# EAGLE design blackmagic_probe_r1 (EAGLE 5.12)
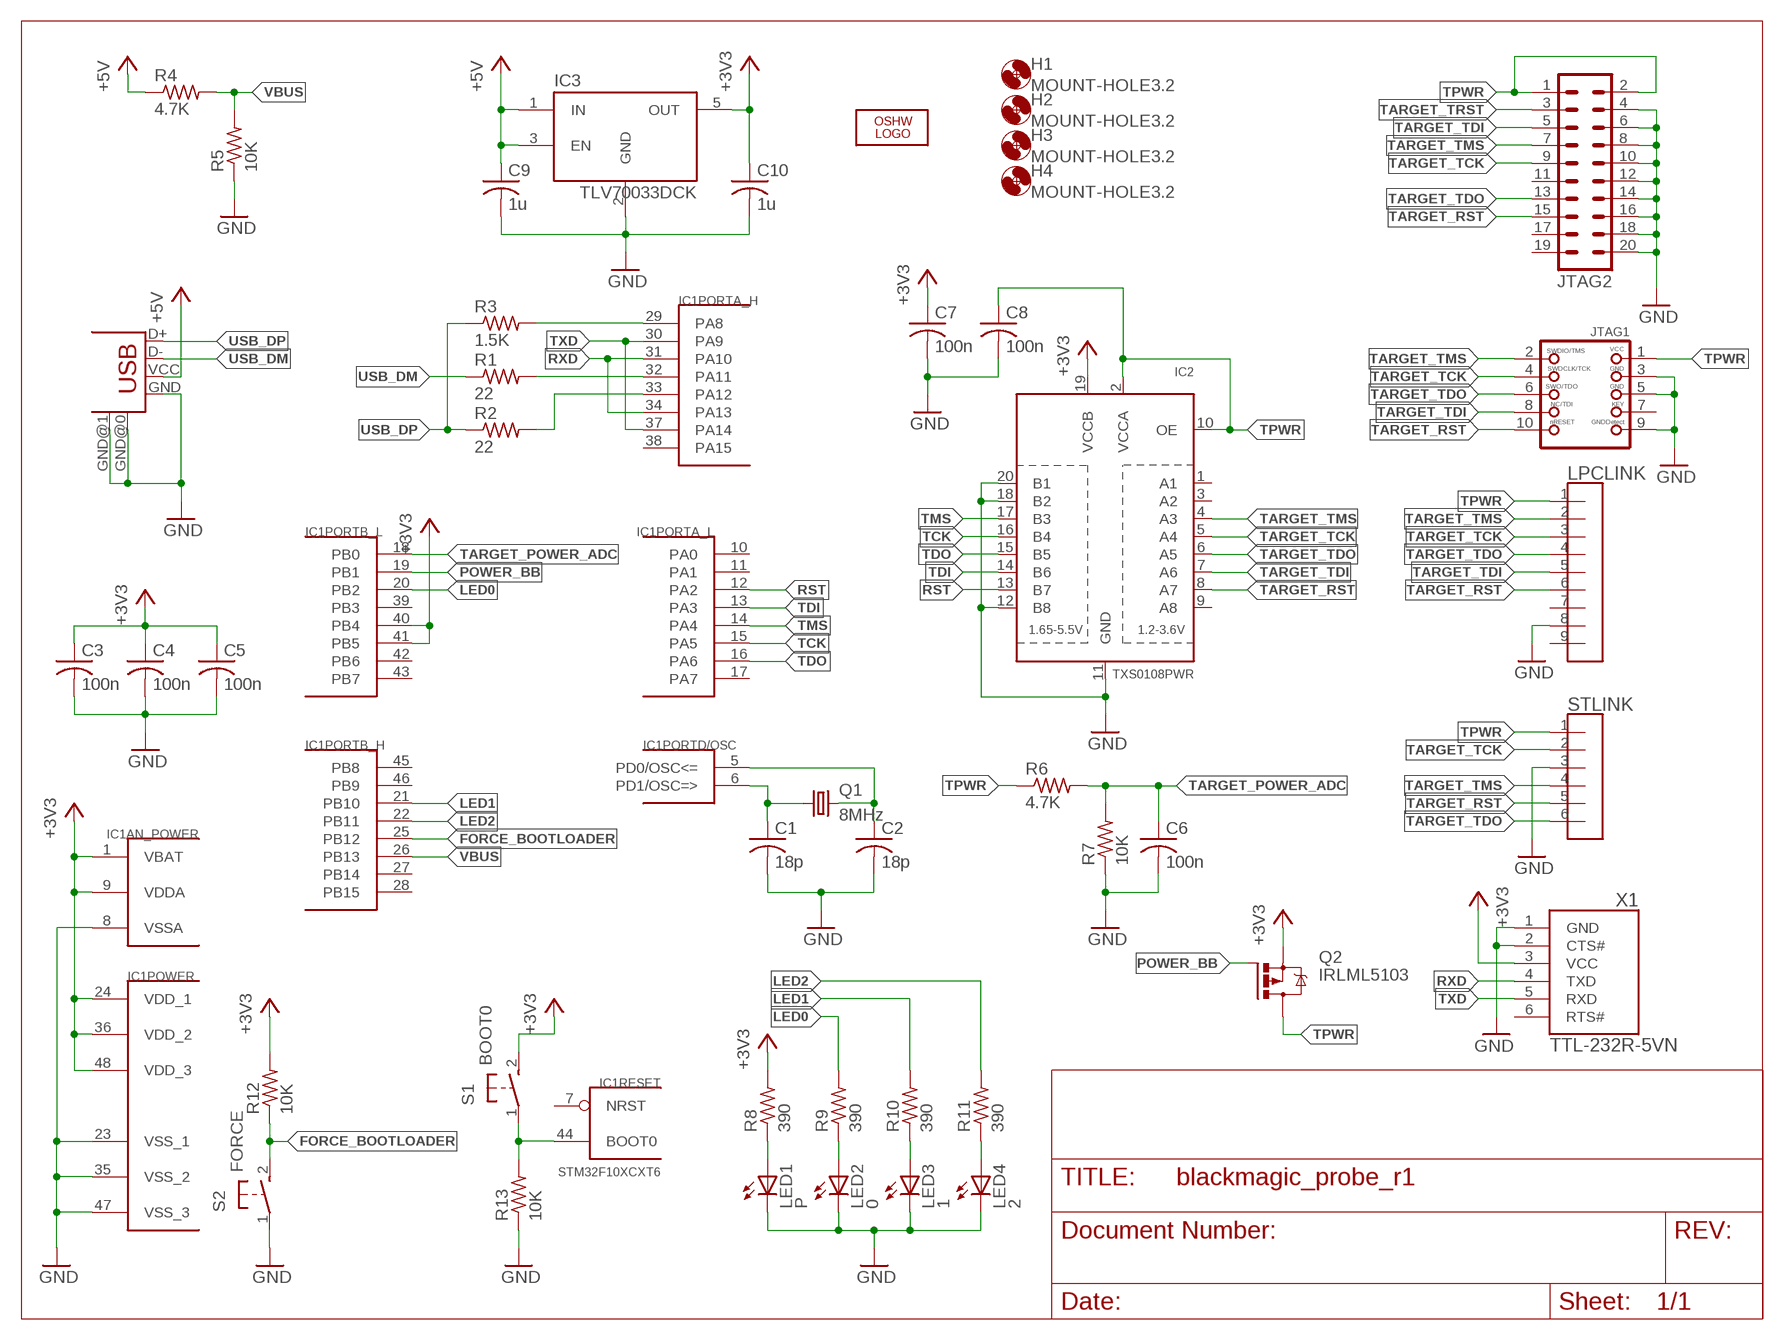
[diagram p0: schematic, sheet 1]

## Parts
C1  18p  C-USC0603  [C0603]
C2  18p  C-USC0603  [C0603]
C3  100n  C-USC0603  [C0603]
C4  100n  C-USC0603  [C0603]
C5  100n  C-USC0603  [C0603]
C6  100n  C-USC0603  [C0603]
C7  100n  C-USC0603  [C0603]
C8  100n  C-USC0603  [C0603]
C9  1u  C-USC0603  [C0603]
C10  1u  C-USC0603  [C0603]
H1  MOUNT-HOLE3.2  [3,2]
H2  MOUNT-HOLE3.2  [3,2]
H3  MOUNT-HOLE3.2  [3,2]
H4  MOUNT-HOLE3.2  [3,2]
IC1  STM32F10XCXT6  [TQFP48]
IC2  TXS0108PWR  TXB0108PWR  [TSSOP20]
IC3  TLV70033DCK  [SC70]
JTAG1  JTAG-CORTEXM3  [2X05_1.27MM_SMT]
JTAG2  ML20  [ML20]
LED1  P  LEDCHIP-LED0603  [CHIP-LED0603]
LED2  0  LEDCHIP-LED0603  [CHIP-LED0603]
LED3  1  LEDCHIP-LED0603  [CHIP-LED0603]
LED4  2  LEDCHIP-LED0603  [CHIP-LED0603]
LOGO1  OSHW_LOGO_FILLX0200-NT  [OSHW_FILLX200_NOTEXT]
LPCLINK  M09-100MIL  [100MIL-9]
Q1  8MHz  CRYSTAL5X3  [CRYSTAL-SMD-5X3]
Q2  IRLML5103  IRLML5203  [MICRO3]
R1  22  R-US_R0603  [R0603]
R2  22  R-US_R0603  [R0603]
R3  1.5K  R-US_R0603  [R0603]
R4  4.7K  R-US_R0603  [R0603]
R5  10K  R-US_R0603  [R0603]
R6  4.7K  R-US_R0603  [R0603]
R7  10K  R-US_R0603  [R0603]
R8  390  R-US_R0603  [R0603]
R9  390  R-US_R0603  [R0603]
R10  390  R-US_R0603  [R0603]
R11  390  R-US_R0603  [R0603]
R12  10K  R-US_R0603  [R0603]
R13  10K  R-US_R0603  [R0603]
S1  BOOT0  TACT-SPSTSMD-6X3.6  [6X3.6-SPST]
S2  FORCE  TACT-SPSTSMD-6X3.6  [6X3.6-SPST]
STLINK  M06-100MIL  [100MIL-6]
USB1  USB-U  [USB-MICROB-ALI]
X1  TTL-232R-5VN  [USBCABLE-0.100-NOLBL]

## Nets
+3V3: C3.1 C4.1 C5.1 C7.1 C10.1 IC1.1(AN_POWER:VBAT) IC1.9(AN_POWER:VDDA) IC1.24(POWER:VDD_1) IC1.36(POWER:VDD_2) IC1.40(PORTB_L:PB4) IC1.41(PORTB_L:PB5) IC1.48(POWER:VDD_3) IC2.19(VCCB) IC3.5(OUT) Q2.2(S) R8.2 R12.2 S1.2(S) X1.3(VCC)
+5V: C9.1 IC3.1(IN) IC3.3(EN) R4.1 USB1.VCC(VBUS)
FORCE_BOOTLOADER: IC1.25(PORTB_H:PB12) R12.1 S2.2(S)
GND: C1.2 C2.2 C3.2 C4.2 C5.2 C6.2 C7.2 C8.2 C9.2 C10.2 IC1.8(AN_POWER:VSSA) IC1.23(POWER:VSS_1) IC1.35(POWER:VSS_2) IC1.47(POWER:VSS_3) IC2.11(GND) IC2.12(B8) IC2.18(B2) IC2.20(B1) IC3.2(GND) JTAG1.3 JTAG1.5 JTAG1.9 JTAG2.4 JTAG2.6 JTAG2.8 JTAG2.10 JTAG2.12 JTAG2.14 JTAG2.16 JTAG2.18 JTAG2.20 LED1.C LED2.C LED3.C LED4.C LPCLINK.8 R5.1 R7.1 R13.1 S2.1(P) STLINK.3 USB1.GND USB1.GND@0(GND) USB1.GND@1(GND) X1.1(GND) X1.2(CTS#)
LED0: IC1.20(PORTB_L:PB2) R9.2
LED1: IC1.21(PORTB_H:PB10) R10.2
LED2: IC1.22(PORTB_H:PB11) R11.2
N$1: C2.1 IC1.5(PORTD/OSC:PD0/OSC<=) Q1.3
N$2: C1.1 IC1.6(PORTD/OSC:PD1/OSC=>) Q1.1
N$3: IC1.29(PORTA_H:PA8) R3.2
N$4: IC1.32(PORTA_H:PA11) R1.2
N$5: IC1.33(PORTA_H:PA12) R2.2
N$6: IC1.44(RESET:BOOT0) R13.2 S1.1(P)
N$7: LED2.A R9.1
N$8: LED1.A R8.1
N$9: LED3.A R10.1
N$10: LED4.A R11.1
POWER_BB: IC1.19(PORTB_L:PB1) Q2.1(G)
RST: IC1.12(PORTA_L:PA2) IC2.13(B7)
RXD: IC1.31(PORTA_H:PA10) IC1.34(PORTA_H:PA13) X1.4(TXD)
TARGET_POWER_ADC: C6.1 IC1.18(PORTB_L:PB0) R6.2 R7.2
TARGET_RST: IC2.8(A7) JTAG1.10 JTAG2.15 LPCLINK.6 STLINK.5
TARGET_TCK: IC2.5(A4) JTAG1.4 JTAG2.9 LPCLINK.3 STLINK.2
TARGET_TDI: IC2.7(A6) JTAG1.8 JTAG2.5 LPCLINK.5
TARGET_TDO: IC2.6(A5) JTAG1.6 JTAG2.13 LPCLINK.4 STLINK.6
TARGET_TMS: IC2.4(A3) JTAG1.2 JTAG2.7 LPCLINK.2 STLINK.4
TARGET_TRST: JTAG2.3
TCK: IC1.15(PORTA_L:PA5) IC2.16(B4)
TDI: IC1.13(PORTA_L:PA3) IC2.14(B6)
TDO: IC1.16(PORTA_L:PA6) IC2.15(B5)
TMS: IC1.14(PORTA_L:PA4) IC2.17(B3)
TPWR: C8.1 IC2.2(VCCA) IC2.10(OE) JTAG1.1 JTAG2.1 JTAG2.2 LPCLINK.1 Q2.3(D) R6.1 STLINK.1
TXD: IC1.30(PORTA_H:PA9) IC1.37(PORTA_H:PA14) X1.5(RXD)
USB_DM: R1.1 USB1.D-
USB_DP: R2.1 R3.1 USB1.D+
VBUS: IC1.26(PORTB_H:PB13) R4.2 R5.2
Unconnected: IC1.2(PORTC:PC13) IC1.3(PORTC:PC14) IC1.4(PORTC:PC15) IC1.7(RESET:NRST) IC1.10(PORTA_L:PA0) IC1.11(PORTA_L:PA1) IC1.17(PORTA_L:PA7) IC1.27(PORTB_H:PB14) IC1.28(PORTB_H:PB15) IC1.38(PORTA_H:PA15) IC1.39(PORTB_L:PB3) IC1.42(PORTB_L:PB6) IC1.43(PORTB_L:PB7) IC1.45(PORTB_H:PB8) IC1.46(PORTB_H:PB9) IC2.1(A1) IC2.3(A2) IC2.9(A8) JTAG1.7 JTAG2.11 JTAG2.17 JTAG2.19 LPCLINK.7 LPCLINK.9 X1.6(RTS#)

## Library data of the parts
C1-C10 = rcl:C-US: CAPACITOR, American symbol
H1-H4 = holes:MOUNT-HOLE: MOUNTING HOLE with drill center marker
IC1 = stm32:STM32F10XCXT6: ST STM32F101/103 48pin LQFP
IC2 = adafruit:TXB0108PWR: 8-Bit Bi-Directional Level Shifter 1.2V-3.6V (VCCA) to 1.65V-5.5V (VCCB) bi-directional level shifter with auto direction sensing. Max data rate - VCCA 1.8V: 20Mbps (50ns), VCCA 3.3V: 100Mbps (10ns) Digikey: 296-21527-1-ND
IC3 = rbg-ti-vreg:TLV70033
JTAG1 = microbuilder:JTAG-CORTEXM3: Serial Wire (SW-DP) Connector This standard 0.05" 10-pin connector is for use with the Cortex M0/M3's native SWD (serial wire debugger) interface (SW-DP). Some boards support a 20-pin combined JTAG+SWD connector (SWJ-DP), such as the LPC1700 family, but many smaller devices only work with SWD which typically use the smaller 10-pin SW-DP connecter (the LPC1300 family, for example, only supports SWD). 2x05 1.27mm/0.05" Connector: This is the standard SMT connector defined by ARM for all Cortex devices, and should be used in most situations and for forward-compatibility since any new devices coming to market will likely use this connector. MOLEX 10 Pin 0.1" Connector: This 0.1" 10 pin connector has the same pin layout as the standard 0.05" connector, but is easier to work with if you are using standard jumper wires or custom cables to connect your SWD hardware. MOLEX 20 Pin 0.1" Connector: This 0.1" 20 pin connector is the same model used for ARM7/ARM9 JTAG debuggers, but is connected to match the pins on the Segger J-Link for ARM (which supports both JTAG and SWD debugging). See the following document from ARM for more information on Cortex M3 Debug Connectors: http://infocenter.arm.com/help/topic/com.arm.doc.faqs/attached/13634/cortex_debug_connectors.pdf And the following page for an overview with images of the different connector types: http://www.keil.com/peripherals/coresight/connectors.asp
JTAG2 = con-harting-ml:ML20: HARTING; OC_FARNELL: unknown; OC_NEWARK: unknown
LED1-LED4 = led:LED: LED OSRAM: - CHIPLED LG R971, LG N971, LY N971, LG Q971, LY Q971, LO R971, LY R971 LH N974, LH R974 LS Q976, LO Q976, LY Q976 LO Q996 - Hyper CHIPLED LW Q18S LB Q993, LB Q99A, LB R99A - SideLED LS A670, LO A670, LY A670, LG A670, LP A670 LB A673, LV A673, LT A673, LW A673 LH A674 LY A675 LS A676, LA A676, LO A676, LY A676, LW A676 LS A679, LY A679, LG A679 - Hyper Micro SIDELED® LS Y876, LA Y876, LO Y876, LY Y876 LT Y87S - SmartLED LW L88C, LW L88S LB L89C, LB L89S, LG L890 LS L89K, LO L89K, LY L89K LS L896, LA L896, LO L896, LY L896 - TOPLED LS T670, LO T670, LY T670, LG T670, LP T670 LSG T670, LSP T670, LSY T670, LOP T670, LYG T670 LG T671, LOG T671, LSG T671 LB T673, LV T673, LT T673, LW T673 LH T674 LS T676, LA T676, LO T676, LY T676, LB T676, LH T676, LSB T676, LW T676 LB T67C, LV T67C, LT T67C, LS T67K, LO T67K, LY T67K, LW E67C LS E67B, LA E67B, LO E67B, LY E67B, LB E67C, LV E67C, LT E67C LW T67C LS T679, LY T679, LG T679 LS T770, LO T770, LY T770, LG T770, LP T770 LB T773, LV T773, LT T773, LW T773 LH T774 LS E675, LA E675, LY E675, LS T675 LS T776, LA T776, LO T776, LY T776, LB T776 LHGB T686 LT T68C, LB T68C - Hyper Mini TOPLED® LB M676 - Mini TOPLED Santana® LG M470 LS M47K, LO M47K, LY M47K Source: http://www.osram.convergy.de LUXEON: - LUMILED® LXK2-PW12-R00, LXK2-PW12-S00, LXK2-PW14-U00, LXK2-PW14-V00 LXK2-PM12-R00, LXK2-PM12-S00, LXK2-PM14-U00 LXK2-PE12-Q00, LXK2-PE12-R00, LXK2-PE12-S00, LXK2-PE14-T00, LXK2-PE14-U00 LXK2-PB12-K00, LXK2-PB12-L00, LXK2-PB12-M00, LXK2-PB14-N00, LXK2-PB14-P00, LXK2-PB14-Q00 LXK2-PR12-L00, LXK2-PR12-M00, LXK2-PR14-Q00, LXK2-PR14-R00 LXK2-PD12-Q00, LXK2-PD12-R00, LXK2-PD12-S00 LXK2-PH12-R00, LXK2-PH12-S00 LXK2-PL12-P00, LXK2-PL12-Q00, LXK2-PL12-R00 Source: www.luxeon.com KINGBRIGHT: KA-3528ASYC Source: www.kingbright.com
LOGO1 = ohw-logo:OSHW_LOGO_FILL
LPCLINK = rbg-generic-headers:M09-100MIL
Q1 = sfe-sparkfun:CRYSTAL: Crystals Various standard crystals. Proven footprints. Spark Fun Electronics SKU : COM-00534
Q2 = transistor-power:IRLML5203: HEXFET P-Channel Power MOSFET
R1-R13 = rcl:R-US_: RESISTOR, American symbol
S1 S2 = rbg-generic-tact-switch:TACT-SPST
STLINK = rbg-generic-headers:M06-100MIL
USB1 = con-usb-2:USB: USB Connectors
X1 = rbg-ftdi-usb:TTL-232R-5V

## Board
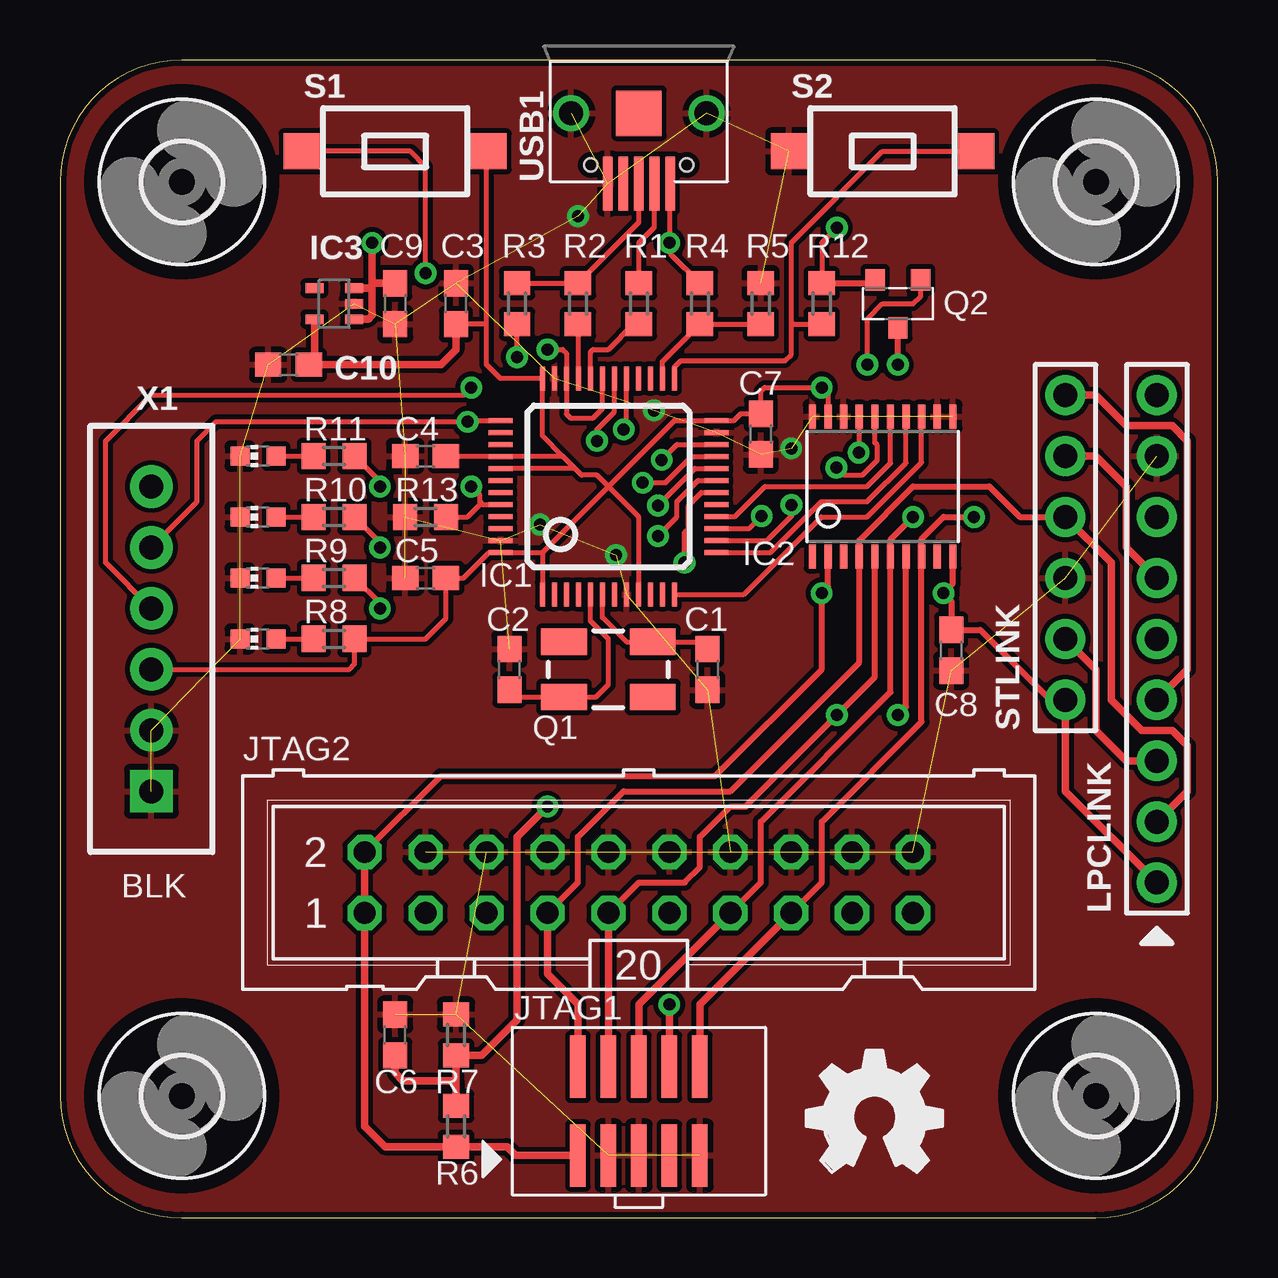
[diagram p1: board, top side]
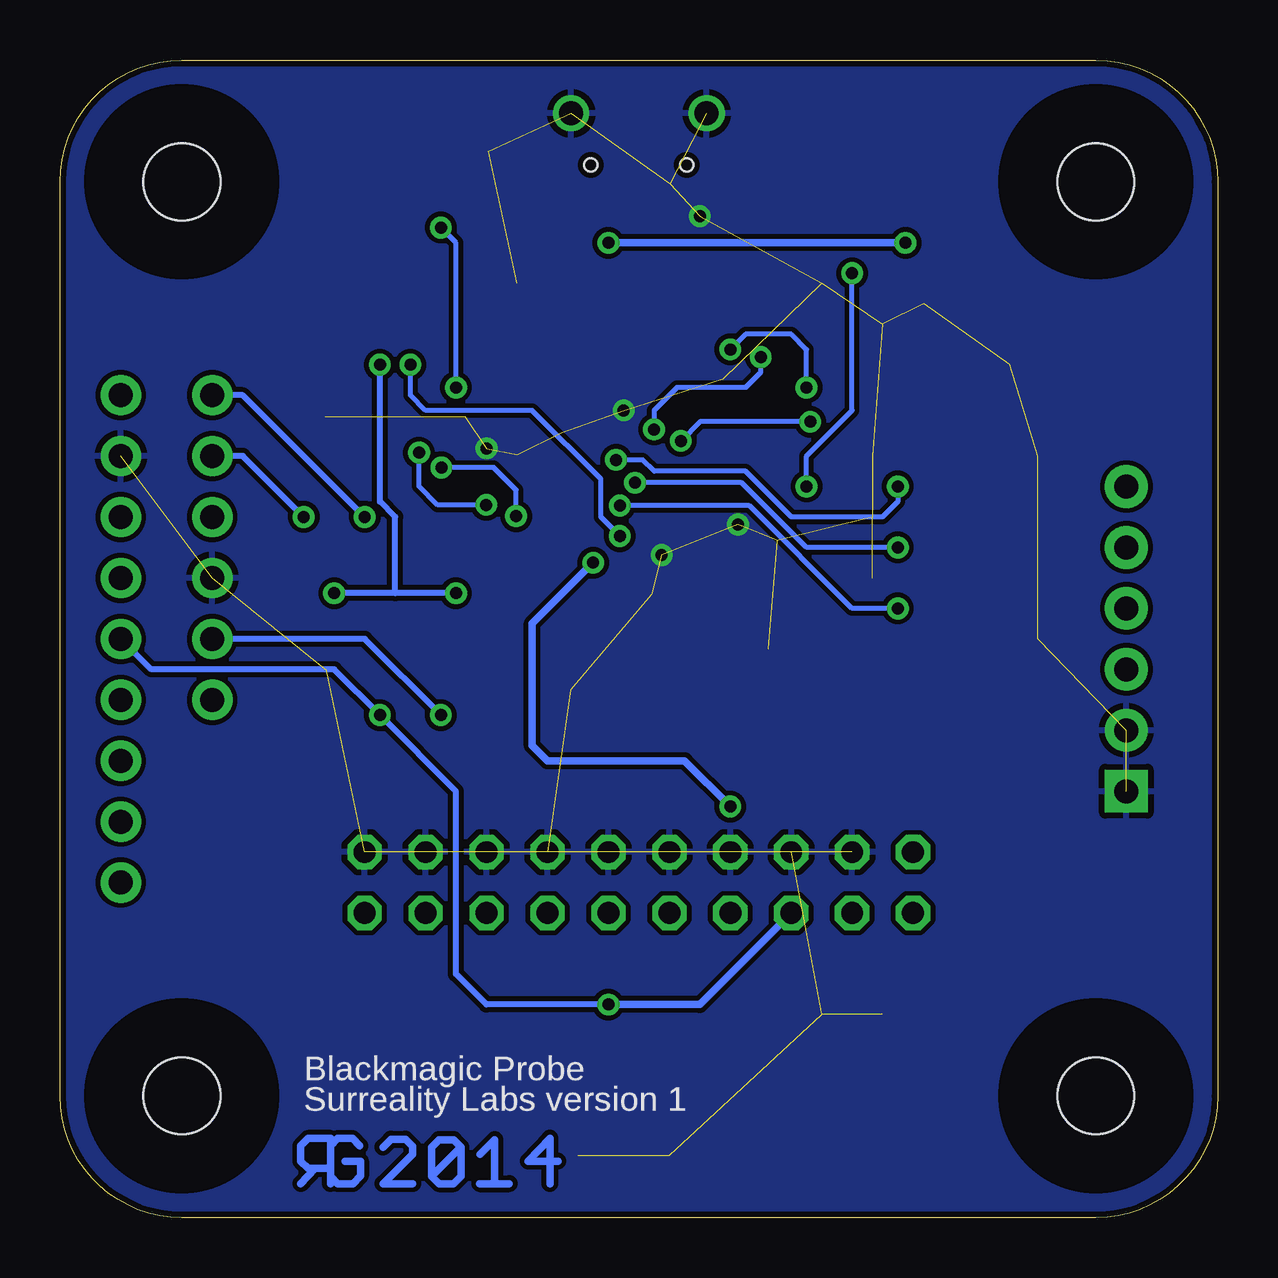
[diagram p2: board, bottom side, seen from below]

Size 48.26 x 48.26 mm. Coordinates in mm from the lower left corner, seen from the top.
Outline: 0,5.08 arc90 5.08,0 43.18,0 arc90 48.26,5.08 48.26,43.18 arc90 43.18,48.26 5.08,48.26 arc90 0,43.18 0,5.08
Copper layers (1*16): Top 0.035mm / dielectric 1.5mm / Bottom 0.035mm
Design rules "default *": minimum track width 7mil, minimum drill 0.5mm, track to track 8mil, track to pad 8mil, pad to pad 8mil, via to via 8mil, smd to smd 8mil, copper to edge 10mil, drill to drill 8mil, minimum pad ring 10mil, minimum via ring 8mil, stop-mask expansion 4mil, vias tented up to drill 20mil, thermal gap 10mil

### Footprints (pad centres in the part's own frame; a part is rotated, then mirrored left to right if it is on the bottom)
C0603 = smd 1.1 x 1: 1 -0.85,0; 2 0.85,0
3,2 = hole 3.2: 0,0
TQFP48 = smd 0.2 x 1: 1 -2.75,-4.5; 2 -2.25,-4.5; 3 -1.75,-4.5; 4 -1.25,-4.5; 5 -0.75,-4.5; 6 -0.25,-4.5; 7 0.25,-4.5; 8 0.75,-4.5; 9 1.25,-4.5; 10 1.75,-4.5; 11 2.25,-4.5; 12 2.75,-4.5; 25 2.75,4.5; 26 2.25,4.5; 27 1.75,4.5; 28 1.25,4.5; 29 0.75,4.5; 30 0.25,4.5; 31 -0.25,4.5; 32 -0.75,4.5; 33 -1.25,4.5; 34 -1.75,4.5; 35 -2.25,4.5; 36 -2.75,4.5 | smd 1 x 0.2: 13 4.5,-2.75; 14 4.5,-2.25; 15 4.5,-1.75; 16 4.5,-1.25; 17 4.5,-0.75; 18 4.5,-0.25; 19 4.5,0.25; 20 4.5,0.75; 21 4.5,1.25; 22 4.5,1.75; 23 4.5,2.25; 24 4.5,2.75; 37 -4.5,2.75; 38 -4.5,2.25; 39 -4.5,1.75; 40 -4.5,1.25; 41 -4.5,0.75; 42 -4.5,0.25; 43 -4.5,-0.25; 44 -4.5,-0.75; 45 -4.5,-1.25; 46 -4.5,-1.75; 47 -4.5,-2.25; 48 -4.5,-2.75
TSSOP20 = smd 0.305 x 0.991: 1 -2.925,-2.918; 2 -2.275,-2.918; 3 -1.625,-2.918; 4 -0.975,-2.918; 5 -0.325,-2.918; 6 0.325,-2.918; 7 0.975,-2.918; 8 1.625,-2.918; 9 2.275,-2.918; 10 2.925,-2.918; 11 2.925,2.918; 12 2.275,2.918; 13 1.625,2.918; 14 0.975,2.918; 15 0.325,2.918; 16 -0.325,2.918; 17 -0.975,2.918; 18 -1.625,2.918; 19 -2.275,2.918; 20 -2.925,2.918
SC70 = smd 0.4 x 0.75: 1 -0.65,-0.825; 2 0,-0.825; 3 0.65,-0.825; 4 0.65,0.825; 5 -0.65,0.825
2X05_1.27MM_SMT = smd 0.65 x 2.6: 1 -2.54,-1.85; 2 -2.54,1.85; 3 -1.27,-1.85; 4 -1.27,1.85; 5 0,-1.85; 6 0,1.85; 7 1.27,-1.85; 8 1.27,1.85; 9 2.54,-1.85; 10 2.54,1.85
ML20 = drill 0.914 octagon: 1 -11.43,-1.27; 2 -11.43,1.27; 3 -8.89,-1.27; 4 -8.89,1.27; 5 -6.35,-1.27; 6 -6.35,1.27; 7 -3.81,-1.27; 8 -3.81,1.27; 9 -1.27,-1.27; 10 -1.27,1.27; 11 1.27,-1.27; 12 1.27,1.27; 13 3.81,-1.27; 14 3.81,1.27; 15 6.35,-1.27; 16 6.35,1.27; 17 8.89,-1.27; 18 8.89,1.27; 19 11.43,-1.27; 20 11.43,1.27
CHIP-LED0603 = smd 0.8 x 0.8: A 0,-0.75; C 0,0.75
100MIL-9 = drill 1 pad 1.676 round: 1 -10.16,0; 2 -7.62,0; 3 -5.08,0; 4 -2.54,0; 5 0,0; 6 2.54,0; 7 5.08,0; 8 7.62,0; 9 10.16,0
CRYSTAL-SMD-5X3 = smd 1.9 x 1.1: 1 -1.85,-1.15; 2 1.85,-1.15; 3 1.85,1.15; 4 -1.85,1.15
MICRO3 = smd 0.8 x 0.9: 1 -0.95,-1; 2 0.95,-1; 3 0,1
R0603 = smd 1 x 1.1: 1 -0.85,0; 2 0.85,0
6X3.6-SPST = smd 1.5 x 1.5: 1 -3.9,0; 2 3.9,0
100MIL-6 = drill 1 pad 1.676 round: 1 -6.35,0; 2 -3.81,0; 3 -1.27,0; 4 1.27,0; 5 3.81,0; 6 6.35,0
USB-MICROB-ALI = smd 0.4 x 2.25: D+ 0,2.925; D- -0.65,2.925; GND 1.3,2.925; ID 0.65,2.925; VCC -1.3,2.925 | drill 1 round: GND@0 -2.825,0; GND@1 2.825,0 | smd 1.9 x 1.9: GND@2 0,0 | hole 0.55: -2,2.15; 2,2.15
USBCABLE-0.100-NOLBL = drill 1 pad 1.778 square: 1 0,-7.62 | drill 1 pad 1.778 round: 2 0,-5.08; 3 0,-2.54; 4 0,0; 5 0,2.54; 6 0,5.08

### Placement (x,y rotation side)
C1  26.99,22.86 270 top
C2  18.73,22.86 90 top
C3  16.51,38.1 90 top
C4  15.24,31.75 180 top
C5  15.24,26.67 180 top
C6  13.97,7.62 90 top
C7  29.21,32.66 270 top
C8  37.15,23.65 270 top
C9  13.97,38.1 270 top
C10  9.52,35.56 180 top
H1  5.08,5.08 0 top
H2  43.18,5.08 0 top
H3  5.08,43.18 0 top
H4  43.18,43.18 0 top
IC1  22.86,30.48 0 top
IC2  34.29,30.48 0 top
IC3  11.43,38.1 90 top
JTAG1  24.13,4.45 0 top
JTAG2  24.13,13.97 0 top
LED1  8.25,24.13 90 top
LED2  8.25,26.67 90 top
LED3  8.25,29.21 90 top
LED4  8.25,31.75 90 top
LOGO1  31.11,1.9 0 top
LPCLINK  45.72,24.13 90 top
Q1  22.86,22.86 180 top
Q2  34.92,38.1 180 top
R1  24.13,38.1 270 top
R2  21.59,38.1 270 top
R3  19.05,38.1 270 top
R4  26.67,38.1 270 top
R5  29.21,38.1 270 top
R6  16.51,3.81 90 top
R7  16.51,7.62 270 top
R8  11.43,24.13 0 top
R9  11.43,26.67 0 top
R10  11.43,29.21 0 top
R11  11.43,31.75 0 top
R12  31.75,38.1 90 top
R13  15.24,29.21 0 top
S1  13.97,44.45 0 top
S2  34.29,44.45 0 top
STLINK  41.91,27.94 90 top
U$1  [RGLOGO_SMALL_2014]  36.83,1.27 0 bottom
USB1  24.13,46.04 180 top
X1  3.81,25.4 0 top

### Tracks (layer width: path | path; a pad name or v marks a point on that pad's centre or on a via)
+3V3  (via drill 0.5)
  Top 0.203: IC1.9 24.11,29.23 22.86,30.48 | 21.47,31.23 IC1.41 | 20.11,27.73 IC1.1 | 20.11,27.73 22.86,30.48 | 20.11,27.73 IC1.48 17.89,27.73 16.83,26.67 C5.1 16.09,24.98 15.24,24.13 R8.2 12.28,23.07 12.06,22.86 X1.3 | 22.86,30.48 25.61,33.23 IC1.24 28.1,33.23 28.38,33.51 C7.1 29.21,34.45 29.37,34.61 v31.75,34.61 32.02,34.34 IC2.19 | 20.97,31.73 IC1.40 16.11,31.73 C4.1 | 21.47,31.23 20.97,31.73 | 20.97,31.73 20.11,32.59 IC1.36 18.36,34.98 17.78,35.56 17.78,37.31 | v32.38,41.27 31.75,40.64 R12.2 | 17.78,37.31 17.78,44.36 S1.2 | C3.1 17.72,37.25 17.78,37.31 | 22.86,30.48 | 22.86,30.48 22.38,30.96 21.75,30.96 21.47,31.23
  Top 0.254: R12.2 33.83,38.95 Q2.2
  Top 0.305: IC3.5 10.6,35.59 C10.1 15.87,35.56 16.51,36.2 C3.1
  Bottom 0.203: v31.75,34.61 31.75,40.64 v32.38,41.27
+5V  (via drill 0.5)
  Top 0.203: 25.43,40.61 USB1.VCC | R4.1 25.43,40.19 25.43,40.61 | v25.4,40.64 25.43,40.61
  Top 0.305: IC3.1 12.27,37.47 12.86,37.47 13.02,37.62 13.02,38.73 | 13.02,38.73 13.02,39.05 | 13.02,39.05 v13.02,40.64 | IC3.3 13,38.75 13.02,38.73 | C9.1 13.12,38.95 13.02,39.05
  Bottom 0.305: v13.02,40.64 v25.4,40.64 25.43,40.64
FORCE_BOOTLOADER
  Top 0.203: IC1.25 25.61,35.45 25.88,35.72 30.22,35.72 30.48,35.98 30.48,37.15 | S2.2 34.29,44.45 30.48,40.64 30.48,37.15 | R12.1 30.58,37.25 30.48,37.15
GND  (via drill 0.5)  (50 unrouted)
  other vias: 24.77,33.66 20,28.89 30.48,32.07 21.59,41.75 23.18,27.62
  pour Top: 0,0 48.26,0 48.26,48.26 0,48.26
  pour Bottom: 0,0 48.26,0 48.26,48.26 0,48.26
LED0  (via drill 0.5)
  Top 0.203: IC1.20 26.47,31.23 v24.92,29.69 | v13.33,25.4 13.33,25.61 R9.2
  Bottom 0.203: v24.92,29.69 19.53,29.69 15.24,25.4 v13.33,25.4
LED1  (via drill 0.5)
  Top 0.203: IC1.21 26.33,31.73 25.24,30.64 v24.29,30.64 | v13.33,27.94 13.33,28.16 R10.2
  Bottom 0.203: v24.29,30.64 19.84,30.64 17.14,27.94 v13.33,27.94
LED2  (via drill 0.5)
  Top 0.203: IC1.22 25.72,32.23 v25.08,31.59 | v13.33,30.48 13.33,30.7 R11.2
  Bottom 0.203: v25.08,31.59 23.97,31.59 23.49,31.11 19.68,31.11 17.78,29.21 13.97,29.21 13.33,29.84 v13.33,30.48
N$1
  Top 0.203: IC1.5 22.11,24.88 22.86,24.13 22.86,22.22 22.34,21.71 Q1.3 19.03,21.71 C2.1
N$2
  Top 0.203: IC1.6 22.61,25.02 23.61,24.01 Q1.1 26.69,24.01 C1.1
N$3  (via drill 0.5)
  Top 0.203: v19.05,35.88 R3.2 | IC1.29 23.61,32.98 v23.49,32.86
  Bottom 0.203: v23.49,32.86 23.49,33.66 22.54,34.61 19.68,34.61 19.05,35.24 v19.05,35.88
N$4
  Top 0.203: IC1.32 22.11,36.08 22.22,36.2 22.86,36.2 23.91,37.25 R1.2
N$5
  Top 0.203: IC1.33 21.61,37.23 R2.2
N$6  (via drill 0.5)
  Top 0.203: R13.2 16.99,29.21 17.51,29.73 17.51,29.84 | 17.51,29.84 17.51,30.12 v17.14,30.48 | v15.24,39.37 15.24,43.81 14.6,44.45 S1.1 | IC1.44 17.62,29.73 17.51,29.84
  Bottom 0.203: v17.14,30.48 17.14,31.75 15.24,33.66 v15.24,39.37
N$7
  Top 0.203: LED2.A R9.1
N$8
  Top 0.203: LED1.A R8.1
N$9
  Top 0.203: LED3.A R10.1
N$10
  Top 0.203: LED4.A R11.1
POWER_BB  (via drill 0.5)
  Top 0.203: IC1.19 26.6,30.73 25.72,29.84 25.72,29.21 v24.92,28.42 | v33.66,35.56 33.66,37.47 34.29,38.1 35.56,38.1 35.88,38.41 Q2.1
  Bottom 0.203: v24.92,28.42 25.72,29.21 25.72,30.8 28.57,33.66 33.02,33.66 33.66,34.29 v33.66,35.56
RST
  Top 0.203: IC2.13 35.91,31.48 33.64,29.21 31.74,29.21 28.51,25.98 IC1.12
RXD  (via drill 0.5)
  Top 0.203: IC1.31 22.61,33.72 22.22,33.34 21.27,33.34 21.11,33.5 IC1.34 21.11,36.04 20.95,36.2 v20.32,36.2 | X1.4 1.9,27.3 1.9,32.38 3.81,34.29 16.83,34.29 v17.14,34.61
  Bottom 0.203: v17.14,34.61 17.14,36.2 17.78,36.83 19.68,36.83 v20.32,36.2
TARGET_POWER_ADC  (via drill 0.5)
  Top 0.203: v26.04,27.3 26.04,28.57 26.19,28.73 26.19,29.69 26.74,30.23 IC1.18
  Top 0.305: 16.51,5.71 R6.2 | 16.51,5.71 R7.2 17.56,6.77 19.05,8.25 19.05,15.87 v20.32,17.14 | C6.1 13.97,6.03 14.29,5.71 16.51,5.71
  Bottom 0.305: v20.32,17.14 22.22,19.05 27.94,19.05 28.57,19.68 28.57,24.77 v26.04,27.3
TARGET_RST  (via drill 0.5)
  Top 0.254: JTAG2.15 31.75,13.97 31.75,16.51 35.91,20.67 IC2.8 35.91,28.29 36.83,29.21 v38.1,29.21
  Top 0.305: JTAG2.15 26.67,8.89 JTAG1.10 | LPCLINK.6 44.45,27.94 44.45,30.48 43.18,31.75 STLINK.5
  Bottom 0.254: v38.1,29.21 40.64,31.75 STLINK.5
TARGET_TCK  (via drill 0.5)
  Top 0.254: IC2.5 33.97,22.54 v32.38,20.95 28.57,17.14 27.94,17.14 26.67,15.87 26.67,14.6 26.04,13.97 24.13,13.97 JTAG2.9
  Top 0.305: LPCLINK.3 44.45,19.05 43.18,20.32 43.18,22.86 STLINK.2 | JTAG1.4 JTAG2.9
  Bottom 0.254: STLINK.2 35.56,24.13 v32.38,20.95
TARGET_TDI  (via drill 0.5)
  Top 0.254: IC2.7 35.27,21.29 v34.92,20.95
  Top 0.305: v25.4,8.89 JTAG1.8
  Bottom 0.254: v25.4,8.89 30.48,8.89 31.75,10.16 31.75,17.78 v34.92,20.95 36.83,22.86 44.45,22.86 LPCLINK.5
  Bottom 0.305: v25.4,8.89 21.59,8.89 JTAG2.5
TARGET_TDO  (via drill 0.5)
  Top 0.254: JTAG2.13 29.21,13.97 29.21,16.51 34.61,21.91 IC2.6 34.61,28.27 v35.56,29.21
  Top 0.305: JTAG2.13 24.13,8.89 JTAG1.6 | LPCLINK.4 46.99,22.86 46.99,32.38 46.36,33.02 44.45,33.02 43.18,34.29 STLINK.6
  Bottom 0.254: v35.56,29.21 40.64,34.29 STLINK.6
TARGET_TMS
  Top 0.254: JTAG2.7 21.59,13.97 21.59,15.87 23.49,17.78 27.94,17.78 33.31,23.15 IC2.4 33.31,28.23 35.56,30.48 38.73,30.48 40,29.21 STLINK.4
  Top 0.305: JTAG2.7 20.32,10.16 21.59,8.89 JTAG1.2 | STLINK.4 43.81,27.3 43.81,21.59 45.08,20.32 46.36,20.32 46.99,19.68 46.99,17.78 LPCLINK.2
TCK  (via drill 0.5)
  Top 0.203: IC2.16 33.97,32.31 34.07,32.2 34.07,31.58 33.45,30.96 32.67,30.96 v32.36,31.27 | IC1.15 28.73,28.73 v29.25,29.25
  Bottom 0.203: v32.36,31.27 30.18,31.27 29.25,30.34 v29.25,29.25
TDI
  Top 0.203: IC1.13 29.62,27.73 31.74,29.84 33.64,29.84 35.27,31.47 IC2.14
TDO
  Top 0.203: IC2.15 34.61,31.45 33.64,30.48 29.39,30.48 28.14,29.23 IC1.16
TMS  (via drill 0.5)
  Top 0.203: IC1.14 29.47,28.23 30.49,29.25 v30.49,29.71 | IC2.17 33.31,31.91 v33.29,31.89
  Bottom 0.203: v30.49,29.71 32.52,29.71 33.29,30.49 v33.29,31.89
TPWR  (via drill 0.5)
  Top 0.254: IC2.2 32.02,26.3 v31.75,26.04 31.75,22.86 27.3,18.41 15.87,18.41 JTAG2.2 | IC2.10 37.22,26.42 v36.83,26.04 37.15,25.72 C8.1 38.36,24.5 41.27,21.59 STLINK.1 | v34.92,35.56 Q2.3
  Top 0.305: JTAG2.2 JTAG2.1 12.7,3.81 13.55,2.96 R6.1 18.63,2.96 18.99,2.59 JTAG1.1 | LPCLINK.1 41.91,17.78 STLINK.1
  Bottom 0.254: v31.75,26.04 34.29,26.04 | 34.29,26.04 v36.83,26.04 | v34.92,35.56 34.92,29.84 34.29,29.21 34.29,26.04
TXD  (via drill 0.5)
  Top 0.203: IC1.30 23.11,33.59 22.38,32.86 v22.38,32.38 | IC1.37 17.04,33.23 v16.99,33.18 6.51,33.18 5.71,32.38 5.71,29.84 X1.5
  Bottom 0.203: v22.38,32.38 21.59,33.18 v16.99,33.18
USB_DM
  Top 0.203: USB1.D- 24.78,41.29 24.13,40.64 R1.1
USB_DP
  Top 0.203: USB1.D+ 24.13,41.49 R2.1 R3.1
VBUS
  Top 0.203: IC1.26 25.11,35.69 R4.2 R5.2

### Text on the board
bNames: Blackmagic Probe | Surreality Labs version 1